# EAGLE design NXT Motor Shield (EAGLE 5.11)
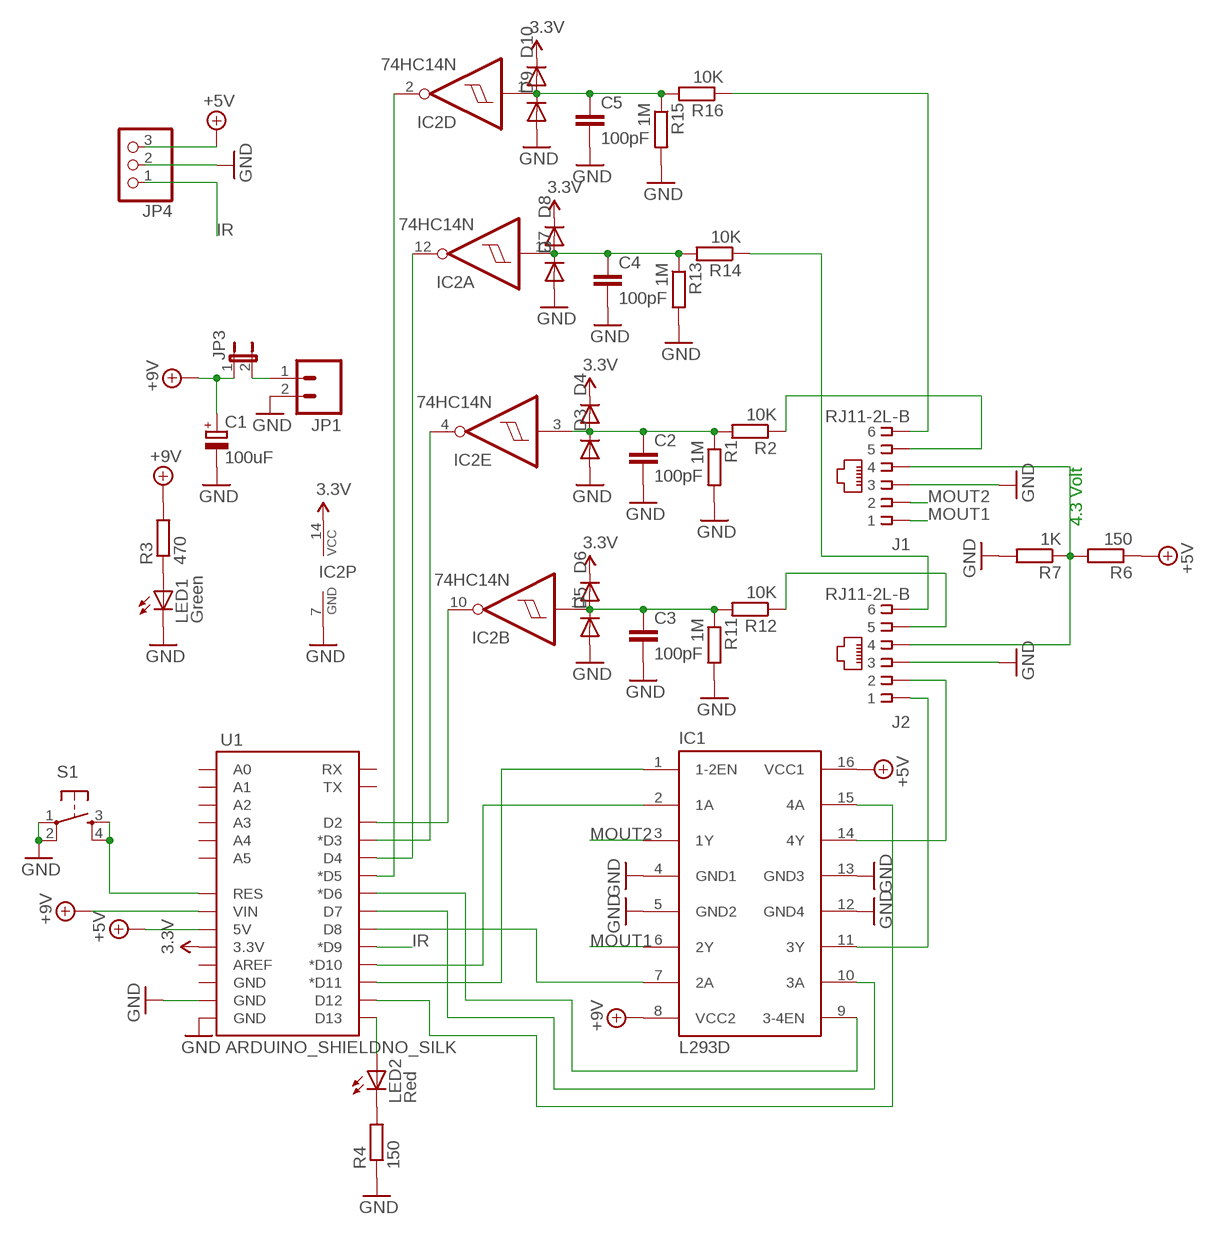
[diagram p0: schematic, sheet 1]

## Parts
C1  100uF  CPOL-EUE2.5-6  [E2,5-6]
C2  100pF  C-EU025-024X044  [C025-024X044]
C3  100pF  C-EU025-024X044  [C025-024X044]
C4  100pF  C-EU025-024X044  [C025-024X044]
C5  100pF  C-EU025-024X044  [C025-024X044]
D3  DIODE1N4148  [DIODE-1N4148]
D4  DIODE1N4148  [DIODE-1N4148]
D5  DIODE1N4148  [DIODE-1N4148]
D6  DIODE1N4148  [DIODE-1N4148]
D7  DIODE1N4148  [DIODE-1N4148]
D8  DIODE1N4148  [DIODE-1N4148]
D9  DIODE1N4148  [DIODE-1N4148]
D10  DIODE1N4148  [DIODE-1N4148]
IC1  L293D  [DIL16]
IC2  74HC14N  [DIL14]
J1  RJ11-2L-B  [RJ11-NO_SHIELD]
J2  RJ11-2L-B  [RJ11-NO_SHIELD]
JP1  M025MM  [SCREWTERMINAL-5MM-2]
JP3  JP1E  [JP1]
JP4  PINHD-1X3  [1X03]
LED1  Green  LED3MM  [LED3MM]
LED2  Red  LED3MM  [LED3MM]
R1  1M  R-EU_0207/10  [0207/10]
R2  10K  R-EU_0207/10  [0207/10]
R3  470  R-EU_0207/10  [0207/10]
R4  150  R-EU_0207/10  [0207/10]
R6  150  R-EU_0207/10  [0207/10]
R7  1K  R-EU_0207/10  [0207/10]
R11  1M  R-EU_0207/10  [0207/10]
R12  10K  R-EU_0207/10  [0207/10]
R13  1M  R-EU_0207/10  [0207/10]
R14  10K  R-EU_0207/10  [0207/10]
R15  1M  R-EU_0207/10  [0207/10]
R16  10K  R-EU_0207/10  [0207/10]
S1  TAC_SWITCHPTH  [TACTILE-PTH]
U1  ARDUINO_SHIELDNO_SILK  [DUEMILANOVE_VIAS]

## Nets
3.3V: D4.C D6.C D8.C D10.C IC2.14(P:VCC) U1.3.3V
+5V: IC1.16(VCC1) JP4.3 R6.1 U1.5V
+9V: C1.+ IC1.8(VCC2) JP3.1 R3.2 U1.VIN
GND: C1.- C2.2 C3.2 C4.2 C5.2 D3.A D5.A D7.A D9.A IC1.4(GND1) IC1.5(GND2) IC1.12(GND4) IC1.13(GND3) IC2.7(P:GND) J1.3 J2.3 JP1.2 JP4.2 LED1.K(C) R1.2 R4.1 R7.2 R11.2 R13.2 R15.2 S1.1 S1.2 U1.GND@0(GND) U1.GND@1(GND)
IR: JP4.1 U1.D9(*D9)
MOUT1: IC1.6(2Y) J1.1
MOUT2: IC1.3(1Y) J1.2
N$1: IC2.2(D:O) U1.D5(*D5)
N$2: IC2.12(A:O) U1.D4
N$3: IC2.4(E:O) U1.D3(*D3)
N$4: IC2.10(B:O) U1.D2
N$5: IC1.1(1-2EN) U1.D11(*D11)
N$6: IC1.7(2A) U1.D8
N$7: IC1.2(1A) U1.D10(*D10)
N$8: IC1.9(3-4EN) U1.D6(*D6)
N$9: IC1.10(3A) U1.D7
N$10: IC1.15(4A) U1.D12
N$11: IC1.14(4Y) J2.2
N$12: J1.5 R2.1
N$13: J1.6 R16.1
N$14: IC1.11(3Y) J2.1
N$15: S1.3 S1.4 U1.RES
N$16: J2.5 R12.1
N$17: LED1.A R3.1
N$18: J2.6 R14.1
N$19: C2.1 D3.C D4.A IC2.3(E:I) R1.1 R2.2
N$20: LED2.A U1.D13
N$21: C3.1 D5.C D6.A IC2.11(B:I) R11.1 R12.2
N$22: C5.1 D9.C D10.A IC2.1(D:I) R15.1 R16.2
N$23: C4.1 D7.C D8.A IC2.13(A:I) R13.1 R14.2
N$24: J1.4 J2.4 R6.2 R7.1
N$25: LED2.K(C) R4.2
N$26: JP1.1 JP3.2
Unconnected: IC2.5(F:I) IC2.6(F:O) IC2.8(C:O) IC2.9(C:I) U1.A0 U1.A1 U1.A2 U1.A3 U1.A4 U1.A5 U1.AREF U1.GND@2(GND) U1.RX U1.TX

## Notes on the sheet
- 4.3 Volt

## Library data of the parts
C1 = rcl:CPOL-EU: POLARIZED CAPACITOR, European symbol
C2-C5 = rcl:C-EU: CAPACITOR, European symbol
D3-D10 = SparkFun:DIODE: Diode These are standard reverse protection diodes and small signal diodes. SMA package can handle up to about 1A. SOD-323 can handle about 200mA. What the SOD-323 package when ordering, there are some mfgs out there that are 5-pin packages.
IC1 = st-microelectronics:L293D: PUSH-PULL 4 CHANNEL DRIVER; MPN: L293D; OC_FARNELL: 9589619; OC_NEWARK: 56P8249
IC2 = 74xx-eu:74*14: Hex schmitt trigger INVERTER
J1 J2 = con-tycoelectronics:RJ11: CORCOM Modular RJ Jacks No Shield Source: www.tycoelectronics.com .. ENG_DS_1654001_1099_RJ_L_0507.pdf; MF: TYCO ELECTRONICS; MPN: RJ11-2L-B; OC_FARNELL: unknown; OC_NEWARK: 83F4463
JP1 = SparkFun:M02: Header 2 Standard 2-pin 0.1" header. Use with straight break away headers (SKU : PRT-00116), right angle break away headers (PRT-00553), swiss pins (PRT-00743), machine pins (PRT-00117), and female headers (PRT-00115). Molex polarized connector foot print use with SKU : PRT-08233 with associated crimp pins and housings.
JP3 = jumper:JP1E: JUMPER
JP4 = pinhead:PINHD-1X3: PIN HEADER
LED1 LED2 = led:LED: LED OSRAM: - CHIPLED LG R971, LG N971, LY N971, LG Q971, LY Q971, LO R971, LY R971 LH N974, LH R974 LS Q976, LO Q976, LY Q976 LO Q996 - Hyper CHIPLED LW Q18S LB Q993, LB Q99A, LB R99A - SideLED LS A670, LO A670, LY A670, LG A670, LP A670 LB A673, LV A673, LT A673, LW A673 LH A674 LY A675 LS A676, LA A676, LO A676, LY A676, LW A676 LS A679, LY A679, LG A679 - Hyper Micro SIDELED® LS Y876, LA Y876, LO Y876, LY Y876 LT Y87S - SmartLED LW L88C, LW L88S LB L89C, LB L89S, LG L890 LS L89K, LO L89K, LY L89K LS L896, LA L896, LO L896, LY L896 - TOPLED LS T670, LO T670, LY T670, LG T670, LP T670 LSG T670, LSP T670, LSY T670, LOP T670, LYG T670 LG T671, LOG T671, LSG T671 LB T673, LV T673, LT T673, LW T673 LH T674 LS T676, LA T676, LO T676, LY T676, LB T676, LH T676, LSB T676, LW T676 LB T67C, LV T67C, LT T67C, LS T67K, LO T67K, LY T67K, LW E67C LS E67B, LA E67B, LO E67B, LY E67B, LB E67C, LV E67C, LT E67C LW T67C LS T679, LY T679, LG T679 LS T770, LO T770, LY T770, LG T770, LP T770 LB T773, LV T773, LT T773, LW T773 LH T774 LS E675, LA E675, LY E675, LS T675 LS T776, LA T776, LO T776, LY T776, LB T776 LHGB T686 LT T68C, LB T68C - Hyper Mini TOPLED® LB M676 - Mini TOPLED Santana® LG M470 LS M47K, LO M47K, LY M47K Source: http://www.osram.convergy.de LUXEON: - LUMILED® LXK2-PW12-R00, LXK2-PW12-S00, LXK2-PW14-U00, LXK2-PW14-V00 LXK2-PM12-R00, LXK2-PM12-S00, LXK2-PM14-U00 LXK2-PE12-Q00, LXK2-PE12-R00, LXK2-PE12-S00, LXK2-PE14-T00, LXK2-PE14-U00 LXK2-PB12-K00, LXK2-PB12-L00, LXK2-PB12-M00, LXK2-PB14-N00, LXK2-PB14-P00, LXK2-PB14-Q00 LXK2-PR12-L00, LXK2-PR12-M00, LXK2-PR14-Q00, LXK2-PR14-R00 LXK2-PD12-Q00, LXK2-PD12-R00, LXK2-PD12-S00 LXK2-PH12-R00, LXK2-PH12-S00 LXK2-PL12-P00, LXK2-PL12-Q00, LXK2-PL12-R00 Source: www.luxeon.com KINGBRIGHT: KA-3528ASYC Source: www.kingbright.com
R1-R4 R6 R7 R11-R16 = rcl:R-EU_: RESISTOR, European symbol
S1 = SparkFun:TAC_SWITCH: Momentary Switch Button commonly used for reset or general input. Spark Fun Electronics SKU : COM-00097
U1 = SparkFun:ARDUINO_SHIELD

## Board
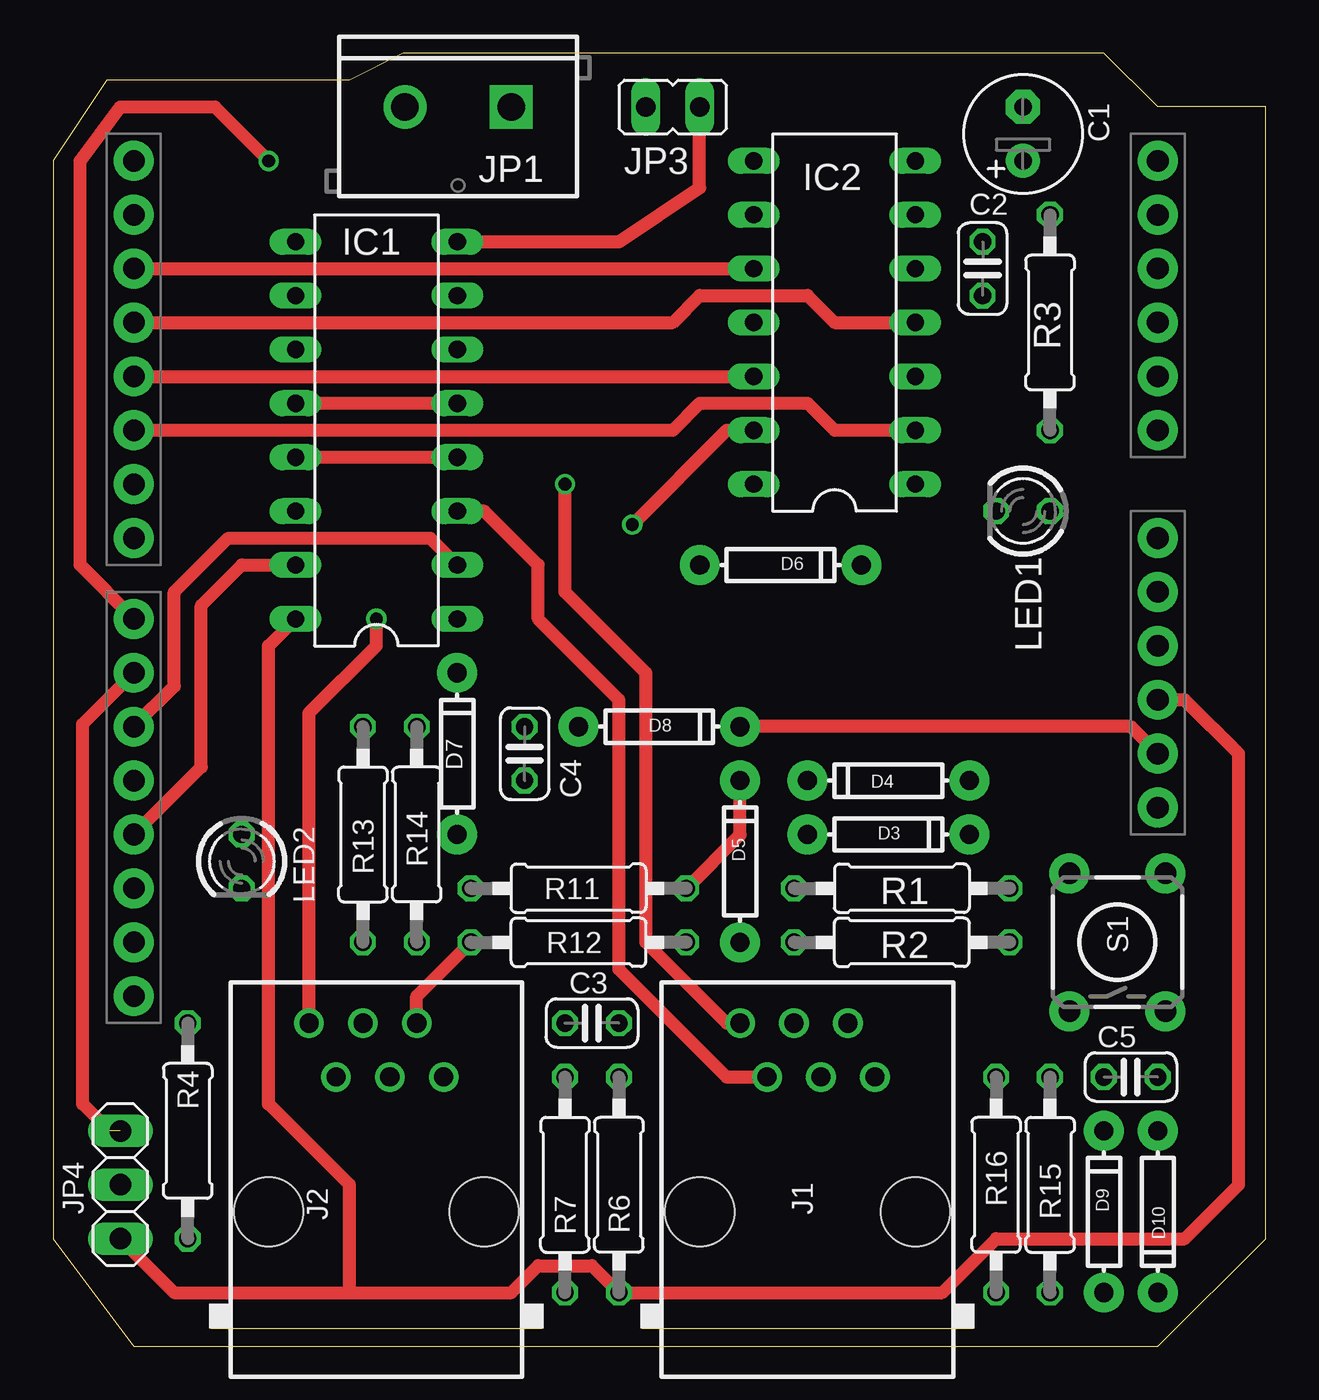
[diagram p1: board, top side]
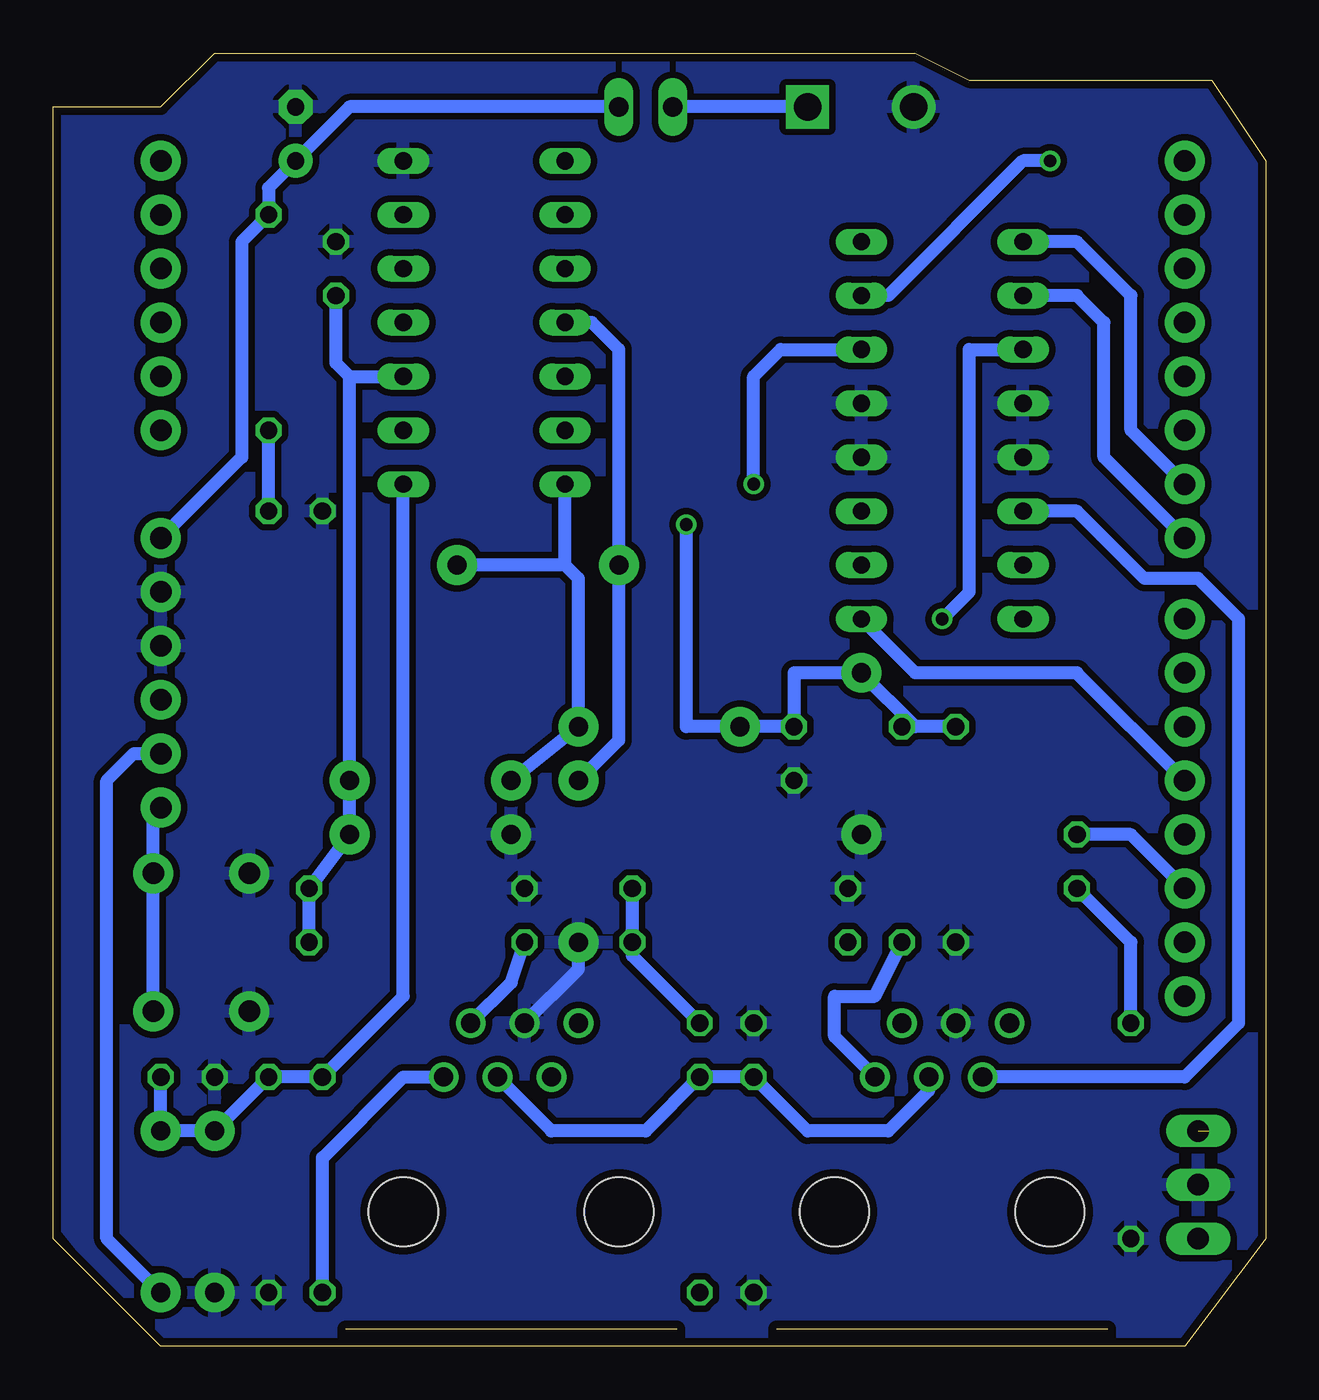
[diagram p2: board, bottom side, seen from below]

Size 57.15 x 60.96 mm. Coordinates in mm from the lower left corner, seen from the top.
Outline: 16.51,60.96 13.97,59.69 2.54,59.69 0,55.88 0,5.08 3.81,0 52.07,0 57.15,5.08 57.15,58.42 52.07,58.42 49.53,60.96 16.51,60.96
Copper layers (1*16): Top 0.0356mm / dielectric 1.5011mm / Bottom 0.0356mm
Design rules "LaenPCBOrder": minimum track width 6mil, minimum drill 13mil, track to track 6mil, track to pad 6mil, pad to pad 6mil, via to via 6mil, smd to smd 6mil, copper to edge 15mil, drill to drill 6mil, minimum pad ring 7mil, minimum via ring 7mil, stop-mask expansion 4mil, vias tented up to drill 25mil, thermal gap 10mil

### Footprints (pad centres in the part's own frame; a part is rotated, then mirrored left to right if it is on the bottom)
E2,5-6 = drill 0.813 pad 1.6 round: + -1.27,0 | drill 0.813 pad 1.6 octagon: - 1.27,0
C025-024X044 = drill 0.813 octagon: 1 -1.27,0; 2 1.27,0
DIODE-1N4148 = drill 0.9 pad 1.88 round: A -3.81,0; C 3.81,0
DIL16 = drill 0.813 long: 1 -8.89,-3.81; 2 -6.35,-3.81; 3 -3.81,-3.81; 4 -1.27,-3.81; 5 1.27,-3.81; 6 3.81,-3.81; 7 6.35,-3.81; 8 8.89,-3.81; 9 8.89,3.81; 10 6.35,3.81; 11 3.81,3.81; 12 1.27,3.81; 13 -1.27,3.81; 14 -3.81,3.81; 15 -6.35,3.81; 16 -8.89,3.81
DIL14 = drill 0.813 long: 1 -7.62,-3.81; 2 -5.08,-3.81; 3 -2.54,-3.81; 4 0,-3.81; 5 2.54,-3.81; 6 5.08,-3.81; 7 7.62,-3.81; 8 7.62,3.81; 9 5.08,3.81; 10 2.54,3.81; 11 0,3.81; 12 -2.54,3.81; 13 -5.08,3.81; 14 -7.62,3.81
RJ11-NO_SHIELD = drill 0.9 pad 1.4 round: 1 -3.175,8.89; 2 -1.905,6.35; 3 -0.635,8.89; 4 0.635,6.35; 5 1.905,8.89; 6 3.175,6.35 | hole 3.251: -5.08,0; 5.08,0
SCREWTERMINAL-5MM-2 = drill 1.3 pad 2.032 square: 1 0,0 | drill 1.3 pad 2.032 round: 2 5,0
JP1 = drill 0.914 long: 1 0,-1.27; 2 0,1.27
1X03 = drill 1.016 long: 1 -2.54,0; 2 0,0; 3 2.54,0
LED3MM = drill 0.813 octagon: A -1.27,0; K 1.27,0
0207/10 = drill 0.813 octagon: 1 -5.08,0; 2 5.08,0
TACTILE-PTH = drill 1.016 pad 1.88 round: 1 -3.251,2.261; 2 3.251,2.261; 3 -3.251,-2.261; 4 3.251,-2.261
DUEMILANOVE_VIAS = drill 1.016 pad 1.88 round: 3.3V 50.8,13.97; 5V 50.8,16.51; A0 50.8,29.21; A1 50.8,31.75; A2 50.8,34.29; A3 50.8,36.83; A4 50.8,39.37; A5 50.8,41.91; AREF 2.54,2.54; D2 2.54,36.83; D3 2.54,34.29; D4 2.54,31.75; D5 2.54,29.21; D6 2.54,26.67; D7 2.54,24.13; D8 2.54,20.32; D9 2.54,17.78; D10 2.54,15.24; D11 2.54,12.7; D12 2.54,10.16; D13 2.54,7.62; GND@0 50.8,19.05; GND@1 50.8,21.59; GND@2 2.54,5.08; RES 50.8,11.43; RX 2.54,41.91; TX 2.54,39.37; VIN 50.8,24.13

### Placement (x,y rotation side)
C1  45.72,57.15 90 top
C2  43.82,50.8 90 top
C3  25.4,15.24 180 top
C4  22.23,27.94 270 top
C5  50.8,12.7 180 top
D3  39.37,24.13 0 top
D4  39.37,26.67 180 top
D5  32.38,22.86 90 top
D6  34.29,36.83 0 top
D7  19.05,27.94 90 top
D8  28.58,29.21 0 top
D9  49.53,6.35 90 top
D10  52.07,6.35 270 top
IC1  15.24,43.18 90 top
IC2  36.83,48.26 90 top
J1  35.56,6.35 0 top
J2  15.24,6.35 0 top
JP1  21.59,58.42 180 top
JP3  29.21,58.42 90 top
JP4  3.18,7.62 270 top
LED1  45.72,39.37 180 top
LED2  8.89,22.86 270 top
R1  40.01,21.59 180 top
R2  40.01,19.05 0 top
R3  46.99,48.26 90 top
R4  6.35,10.16 90 top
R6  26.67,7.62 90 top
R7  24.13,7.62 270 top
R11  24.77,21.59 180 top
R12  24.77,19.05 0 top
R13  14.6,24.13 270 top
R14  17.15,24.13 90 top
R15  46.99,7.62 270 top
R16  44.45,7.62 90 top
S1  50.16,19.05 90 top
U1  1.27,13.97 0 top

### Tracks (layer width: path | path; a pad name or v marks a point on that pad's centre or on a via)
3.3V
  Top 0.61: U1.3.3V 50.8,29.21 D8.C
  Bottom 0.61: U1.3.3V 53.34,27.94 54.61,26.67 54.61,5.08 D10.C | 33.02,36.83 D6.C | 33.02,36.83 IC2.14 | D4.C D8.C 32.38,36.2 33.02,36.83
+5V
  Top 0.61: U1.5V 53.34,30.48 55.88,27.94 55.88,7.62 53.34,5.08 44.45,5.08 41.91,2.54 R6.1 25.4,3.81 22.86,3.81 21.59,2.54 13.97,2.54 | IC1.16 10.16,33.02 10.16,11.43 13.97,7.62 13.97,2.54 | JP4.3 5.71,2.54 13.97,2.54
+9V
  Top 0.61: IC1.8 26.67,52.07 30.48,54.61 JP3.1
  Bottom 0.61: JP3.1 43.18,58.42 C1.+ 46.99,54.61 R3.2 48.26,52.07 48.26,41.91 U1.VIN
GND
  Top 0.61: IC1.12 IC1.5 | IC1.13 IC1.4
  Bottom 0.61: J1.3 32.38,17.78 D5.A
  pour Bottom (isolate 0.305): 57.15,58.42 52.07,58.42 49.53,60.96 3.81,60.96 0,55.88 0,5.08 3.81,0 52.07,0 57.15,6.35
IR  (1 unrouted)
  Top 0.61: U1.D9 1.4,29.34 1.4,11.43 2.67,10.16
MOUT1  (via drill 0.6)
  Top 0.61: J1.1 31.75,15.24 27.94,19.05 27.94,31.75 24.13,35.56 v24.13,40.64
  Bottom 0.61: IC1.6 22.86,46.99 24.13,45.72 v24.13,40.64
MOUT2
  Top 0.61: IC1.3 20.32,39.37 22.86,36.83 22.86,34.29 26.67,30.48 26.67,17.78 31.75,12.7 J1.2
N$1
  Top 0.61: U1.D5 29.21,43.18 30.48,44.45 35.56,44.45 36.83,43.18 IC2.2
N$2
  Top 0.61: U1.D4 IC2.12
N$3
  Top 0.61: U1.D3 29.21,48.26 30.48,49.53 35.56,49.53 36.83,48.26 IC2.4
N$4
  Top 0.61: U1.D2 IC2.10
N$5
  Bottom 0.61: U1.D11 8.89,31.75 16.51,31.75 IC1.1
N$6  (via drill 0.6)
  Top 0.61: U1.D8 1.27,36.83 1.27,55.88 3.18,58.42 7.62,58.42 v10.16,55.88
  Bottom 0.61: v10.16,55.88 11.43,55.88 17.78,49.53 IC1.7
N$7
  Top 0.61: U1.D10 5.71,31.12 5.71,35.56 8.25,38.1 17.78,38.1 IC1.2
N$8
  Bottom 0.61: U1.D6 6.35,43.18 6.35,49.53 8.89,52.07 IC1.9
N$9
  Bottom 0.61: U1.D7 7.62,41.91 7.62,48.26 8.89,49.53 IC1.10
N$10
  Top 0.61: U1.D12 6.98,27.3 6.98,34.93 8.89,36.83 IC1.15
N$11
  Bottom 0.61: J2.2 3.81,12.7 1.27,15.24 1.27,34.29 3.18,36.2 5.71,36.2 8.89,39.37 IC1.14
N$12
  Bottom 0.61: J1.5 35.56,17.14 R2.1
N$13
  Bottom 0.61: J1.6 40.64,12.7 44.45,8.89 R16.1
N$14  (via drill 0.6)
  Top 0.61: J2.1 12.06,29.84 15.24,33.02 v15.24,34.29
  Bottom 0.61: IC1.11 13.97,46.99 13.97,35.56 v15.24,34.29
N$15
  Bottom 0.61: U1.RES 52.43,25.04 S1.4 S1.3
N$16
  Top 0.61: J2.5 17.15,16.51 R12.1
N$17
  Bottom 0.61: LED1.A R3.1
N$18
  Bottom 0.61: J2.6 20.32,14.6 20.32,16.51 18.41,16.51 R14.1
N$19
  Bottom 0.61: R2.2 R1.1 D3.C D4.A 43.18,45.72 | 43.18,45.72 IC2.3 | C2.1 43.82,46.36 43.18,45.72
N$20
  Bottom 0.61: U1.D13 6.35,24.13 LED2.A
N$21
  Top 0.61: D5.C 32.38,24.13 R11.1
  Bottom 0.61: C3.1 29.84,18.41 R12.2 R11.1 | D5.C 30.48,28.58 D6.A 30.48,46.99 31.75,48.26 IC2.11
N$22
  Bottom 0.61: C5.1 D10.A D9.C R15.1 R16.2 40.64,16.51 IC2.1
N$23  (via drill 0.6)
  Top 0.61: v27.3,38.73 31.75,43.18 IC2.13
  Bottom 0.61: v27.3,38.73 27.3,29.21 D8.A C4.1 22.23,31.75 D7.C 16.51,29.21 R14.2 R13.1
N$24
  Bottom 0.61: J2.4 15.88,12.06 17.78,10.16 21.59,10.16 R7.1 R6.2 29.21,10.16 33.66,10.16 J1.4
N$25
  Bottom 0.61: LED2.K 6.35,19.05 R4.2
N$26
  Bottom 0.61: JP1.1 JP3.2

### Text on the board
tDocu: +9V | GND